# EAGLE schematic RC Receiver (EAGLE 6.5.0)
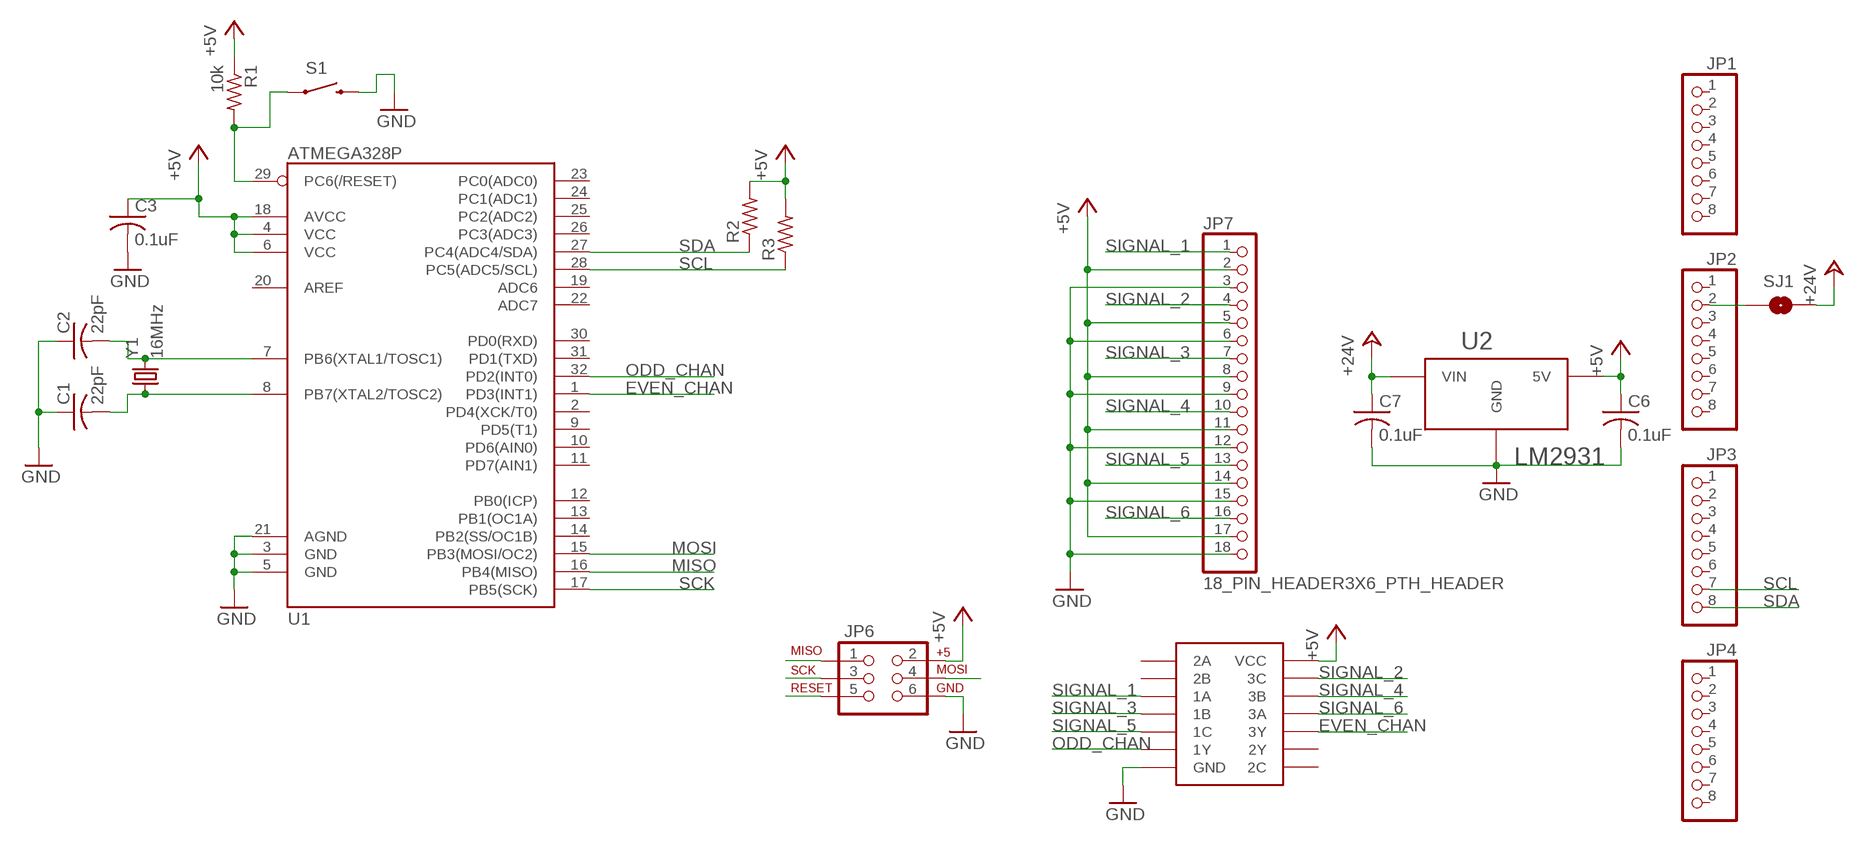
[diagram p0: schematic, sheet 1]

## Parts
C1  22pF  C-USC0603  [C0603]
C2  22pF  C-USC0603  [C0603]
C3  0.1uF  C-USC0603  [C0603]
C6  0.1uF  C-USC0603  [C0603]
C7  0.1uF  C-USC0603  [C0603]
JP1  PINHD-1X81X08_NO_SILK  [1X08_NO_SS]
JP2  PINHD-1X81X08_NO_SILK  [1X08_NO_SS]
JP3  PINHD-1X81X08_NO_SILK  [1X08_NO_SS]
JP4  PINHD-1X81X08_NO_SILK  [1X08_NO_SS]
JP6  AVR_SPI_PRG_62X3_LOCK  [2X3_LOCK]
JP7  18_PIN_HEADER3X6_PTH_HEADER  [3X6_PTH_HEADER]
R1  10k  R-US_R0603  [R0603]
R2  R-US_R0603  [R0603]
R3  R-US_R0603  [R0603]
S1  SWITCH-MOMENTARY-2SMD  [TACTILE_SWITCH_SMD]
SJ1  SOLDERJUMPERNC  [SJ_2S]
U1  ATMEGA328P  ATMEGA328_SMT  [TQFP32-08]
U2  LM2931  [TO263]
U$1  C74HC407514-SOIC  [14-SOIC]
Y1  16MHz  CRYSTAL5X3  [CRYSTAL-SMD-5X3]

## Nets
+5V: C3.1 C6.1 JP6.2 JP7.2 JP7.5 JP7.8 JP7.11 JP7.14 JP7.17 R1.1 R2.2 R3.2 U1.4(VCC) U1.6(VCC) U1.18(AVCC) U2.P$3(5V) U$1.P$14(VCC)
+24V: C7.1 SJ1.2 U2.P$2(VIN)
EVEN_CHAN: U1.1(PD3(INT1)) U$1.P$12(3Y)
GND: C1.1 C2.1 C3.2 C6.2 C7.2 JP6.6 JP7.3 JP7.6 JP7.9 JP7.12 JP7.15 JP7.18 S1.3 U1.3(GND) U1.5(GND) U1.21(AGND) U2.P$1(GND) U$1.P$13(GND)
MISO: JP6.1 U1.16(PB4(MISO))
MOSI: JP6.4 U1.15(PB3(MOSI/OC2))
N$1: C2.2 U1.7(PB6(XTAL1/TOSC1)) Y1.3
N$2: C1.2 U1.8(PB7(XTAL2/TOSC2)) Y1.1
N$5: JP2.2 SJ1.1
ODD_CHAN: U1.32(PD2(INT0)) U$1.P$4(1Y)
RESET: JP6.5 R1.2 S1.1 U1.29(PC6(/RESET))
SCK: JP6.3 U1.17(PB5(SCK))
SCL: JP3.7 R3.1 U1.28(PC5(ADC5/SCL))
SDA: JP3.8 R2.1 U1.27(PC4(ADC4/SDA))
SIGNAL_1: JP7.1 U$1.P$1(1A)
SIGNAL_2: JP7.4 U$1.P$11(3C)
SIGNAL_3: JP7.7 U$1.P$2(1B)
SIGNAL_4: JP7.10 U$1.P$10(3B)
SIGNAL_5: JP7.13 U$1.P$3(1C)
SIGNAL_6: JP7.16 U$1.P$9(3A)
Unconnected: JP1.1 JP1.2 JP1.3 JP1.4 JP1.5 JP1.6 JP1.7 JP1.8 JP2.1 JP2.3 JP2.4 JP2.5 JP2.6 JP2.7 JP2.8 JP3.1 JP3.2 JP3.3 JP3.4 JP3.5 JP3.6 JP4.1 JP4.2 JP4.3 JP4.4 JP4.5 JP4.6 JP4.7 JP4.8 U1.2(PD4(XCK/T0)) U1.9(PD5(T1)) U1.10(PD6(AIN0)) U1.11(PD7(AIN1)) U1.12(PB0(ICP)) U1.13(PB1(OC1A)) U1.14(PB2(SS/OC1B)) U1.19(ADC6) U1.20(AREF) U1.22(ADC7) U1.23(PC0(ADC0)) U1.24(PC1(ADC1)) U1.25(PC2(ADC2)) U1.26(PC3(ADC3)) U1.30(PD0(RXD)) U1.31(PD1(TXD)) U$1.P$5(2A) U$1.P$6(2B) U$1.P$7(2C) U$1.P$8(2Y)

## Library data of the parts
C1-C3 C6 C7 = resistor:C-US: CAPACITOR, American symbol
JP1-JP4 = pinhead:PINHD-1X8: PIN HEADER
JP6 = SparkFun-Connectors:AVR_SPI_PRG_6: AVR ISP 6 Pin This is the reduced ISP connector for AVR programming. Common on Arduino. This footprint will take up less PCB space and can be used with a 10-pin to 6-pin adapter such as SKU: BOB-08508
JP7 = My Parts:18_PIN_HEADER
R1-R3 = resistor:R-US_: RESISTOR, American symbol
S1 = SparkFun-Electromechanical:SWITCH-MOMENTARY-2: Various NO switches- pushbuttons, reed, etc
SJ1 = SparkFun-Passives:SOLDERJUMPER: Solder Jumper Standard SMD solder jumper. Used to automate production. Two varients : Normally Open and Normally Closed are the same, but have different paste layers. NC will have a large amount of paste and should jumper during reflow.
U1 = SparkFun-DigitalIC:ATMEGA328_SMT: 32-Pin Atmega328 part Commonly used on Arduino compatible boards Available in QFP and QFN packages TQFP is IC-09069 QFN is non-stock; PROD_ID: IC-09069
U2 = on-semiconductor:LM2931; PART#: lm2931
U$1 = My Parts:C74HC4075; PART#: 296-14534-1-ND
Y1 = SparkFun-FreqCtrl:CRYSTAL: Various standard crystals. Proven footprints. Spark Fun Electronics SKU : COM-00534; PART#: 535-10226-1-ND